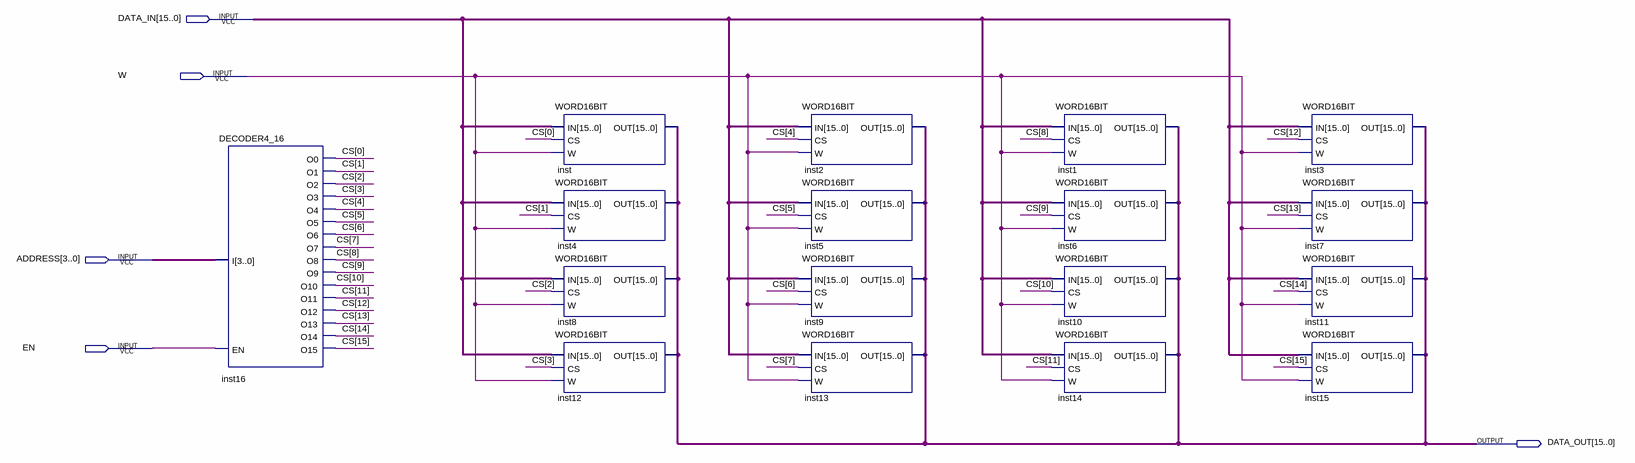
[diagram p0: schematic sheet]
// Quartus schematic RAM.bdf as structural Verilog: 17 symbols, 5 pins
module RAM (
  input  [15:0] DATA_IN,
  input  W,
  input  [3:0] ADDRESS,
  input  EN,
  output [15:0] DATA_OUT
);

  wire [15:0] CS;

  DECODER4_16 inst16 (
    .EN(EN), .I(ADDRESS), .O3(CS[3]), .O0(CS[0]), .O4(CS[4]), .O1(CS[1]), .O5(CS[5]), .O2(CS[2]), .O6(CS[6]),
    .O7(CS[7]), .O8(CS[8]), .O9(CS[9]), .O10(CS[10]), .O11(CS[11]), .O12(CS[12]), .O13(CS[13]), .O14(CS[14]),
    .O15(CS[15]));
  WORD16BIT inst (.IN(DATA_IN), .CS(CS[0]), .W(W), .OUT(DATA_OUT));
  WORD16BIT inst4 (.IN(DATA_IN), .CS(CS[1]), .W(W), .OUT(DATA_OUT));
  WORD16BIT inst8 (.IN(DATA_IN), .CS(CS[2]), .W(W), .OUT(DATA_OUT));
  WORD16BIT inst12 (.IN(DATA_IN), .CS(CS[3]), .W(W), .OUT(DATA_OUT));
  WORD16BIT inst2 (.IN(DATA_IN), .CS(CS[4]), .W(W), .OUT(DATA_OUT));
  WORD16BIT inst5 (.IN(DATA_IN), .CS(CS[5]), .W(W), .OUT(DATA_OUT));
  WORD16BIT inst9 (.IN(DATA_IN), .CS(CS[6]), .W(W), .OUT(DATA_OUT));
  WORD16BIT inst13 (.IN(DATA_IN), .CS(CS[7]), .W(W), .OUT(DATA_OUT));
  WORD16BIT inst1 (.IN(DATA_IN), .CS(CS[8]), .W(W), .OUT(DATA_OUT));
  WORD16BIT inst6 (.IN(DATA_IN), .CS(CS[9]), .W(W), .OUT(DATA_OUT));
  WORD16BIT inst10 (.IN(DATA_IN), .CS(CS[10]), .W(W), .OUT(DATA_OUT));
  WORD16BIT inst14 (.IN(DATA_IN), .CS(CS[11]), .W(W), .OUT(DATA_OUT));
  WORD16BIT inst3 (.IN(DATA_IN), .CS(CS[12]), .W(W), .OUT(DATA_OUT));
  WORD16BIT inst7 (.IN(DATA_IN), .CS(CS[13]), .W(W), .OUT(DATA_OUT));
  WORD16BIT inst11 (.IN(DATA_IN), .CS(CS[14]), .W(W), .OUT(DATA_OUT));
  WORD16BIT inst15 (.IN(DATA_IN), .CS(CS[15]), .W(W), .OUT(DATA_OUT));
endmodule
